# EasyEDA Pro project ProPrj_筷子_2024-10-24-09-22-03.epro

# Schematic Schematic1
Board Name: Board1; Create Date: 2024-10-07
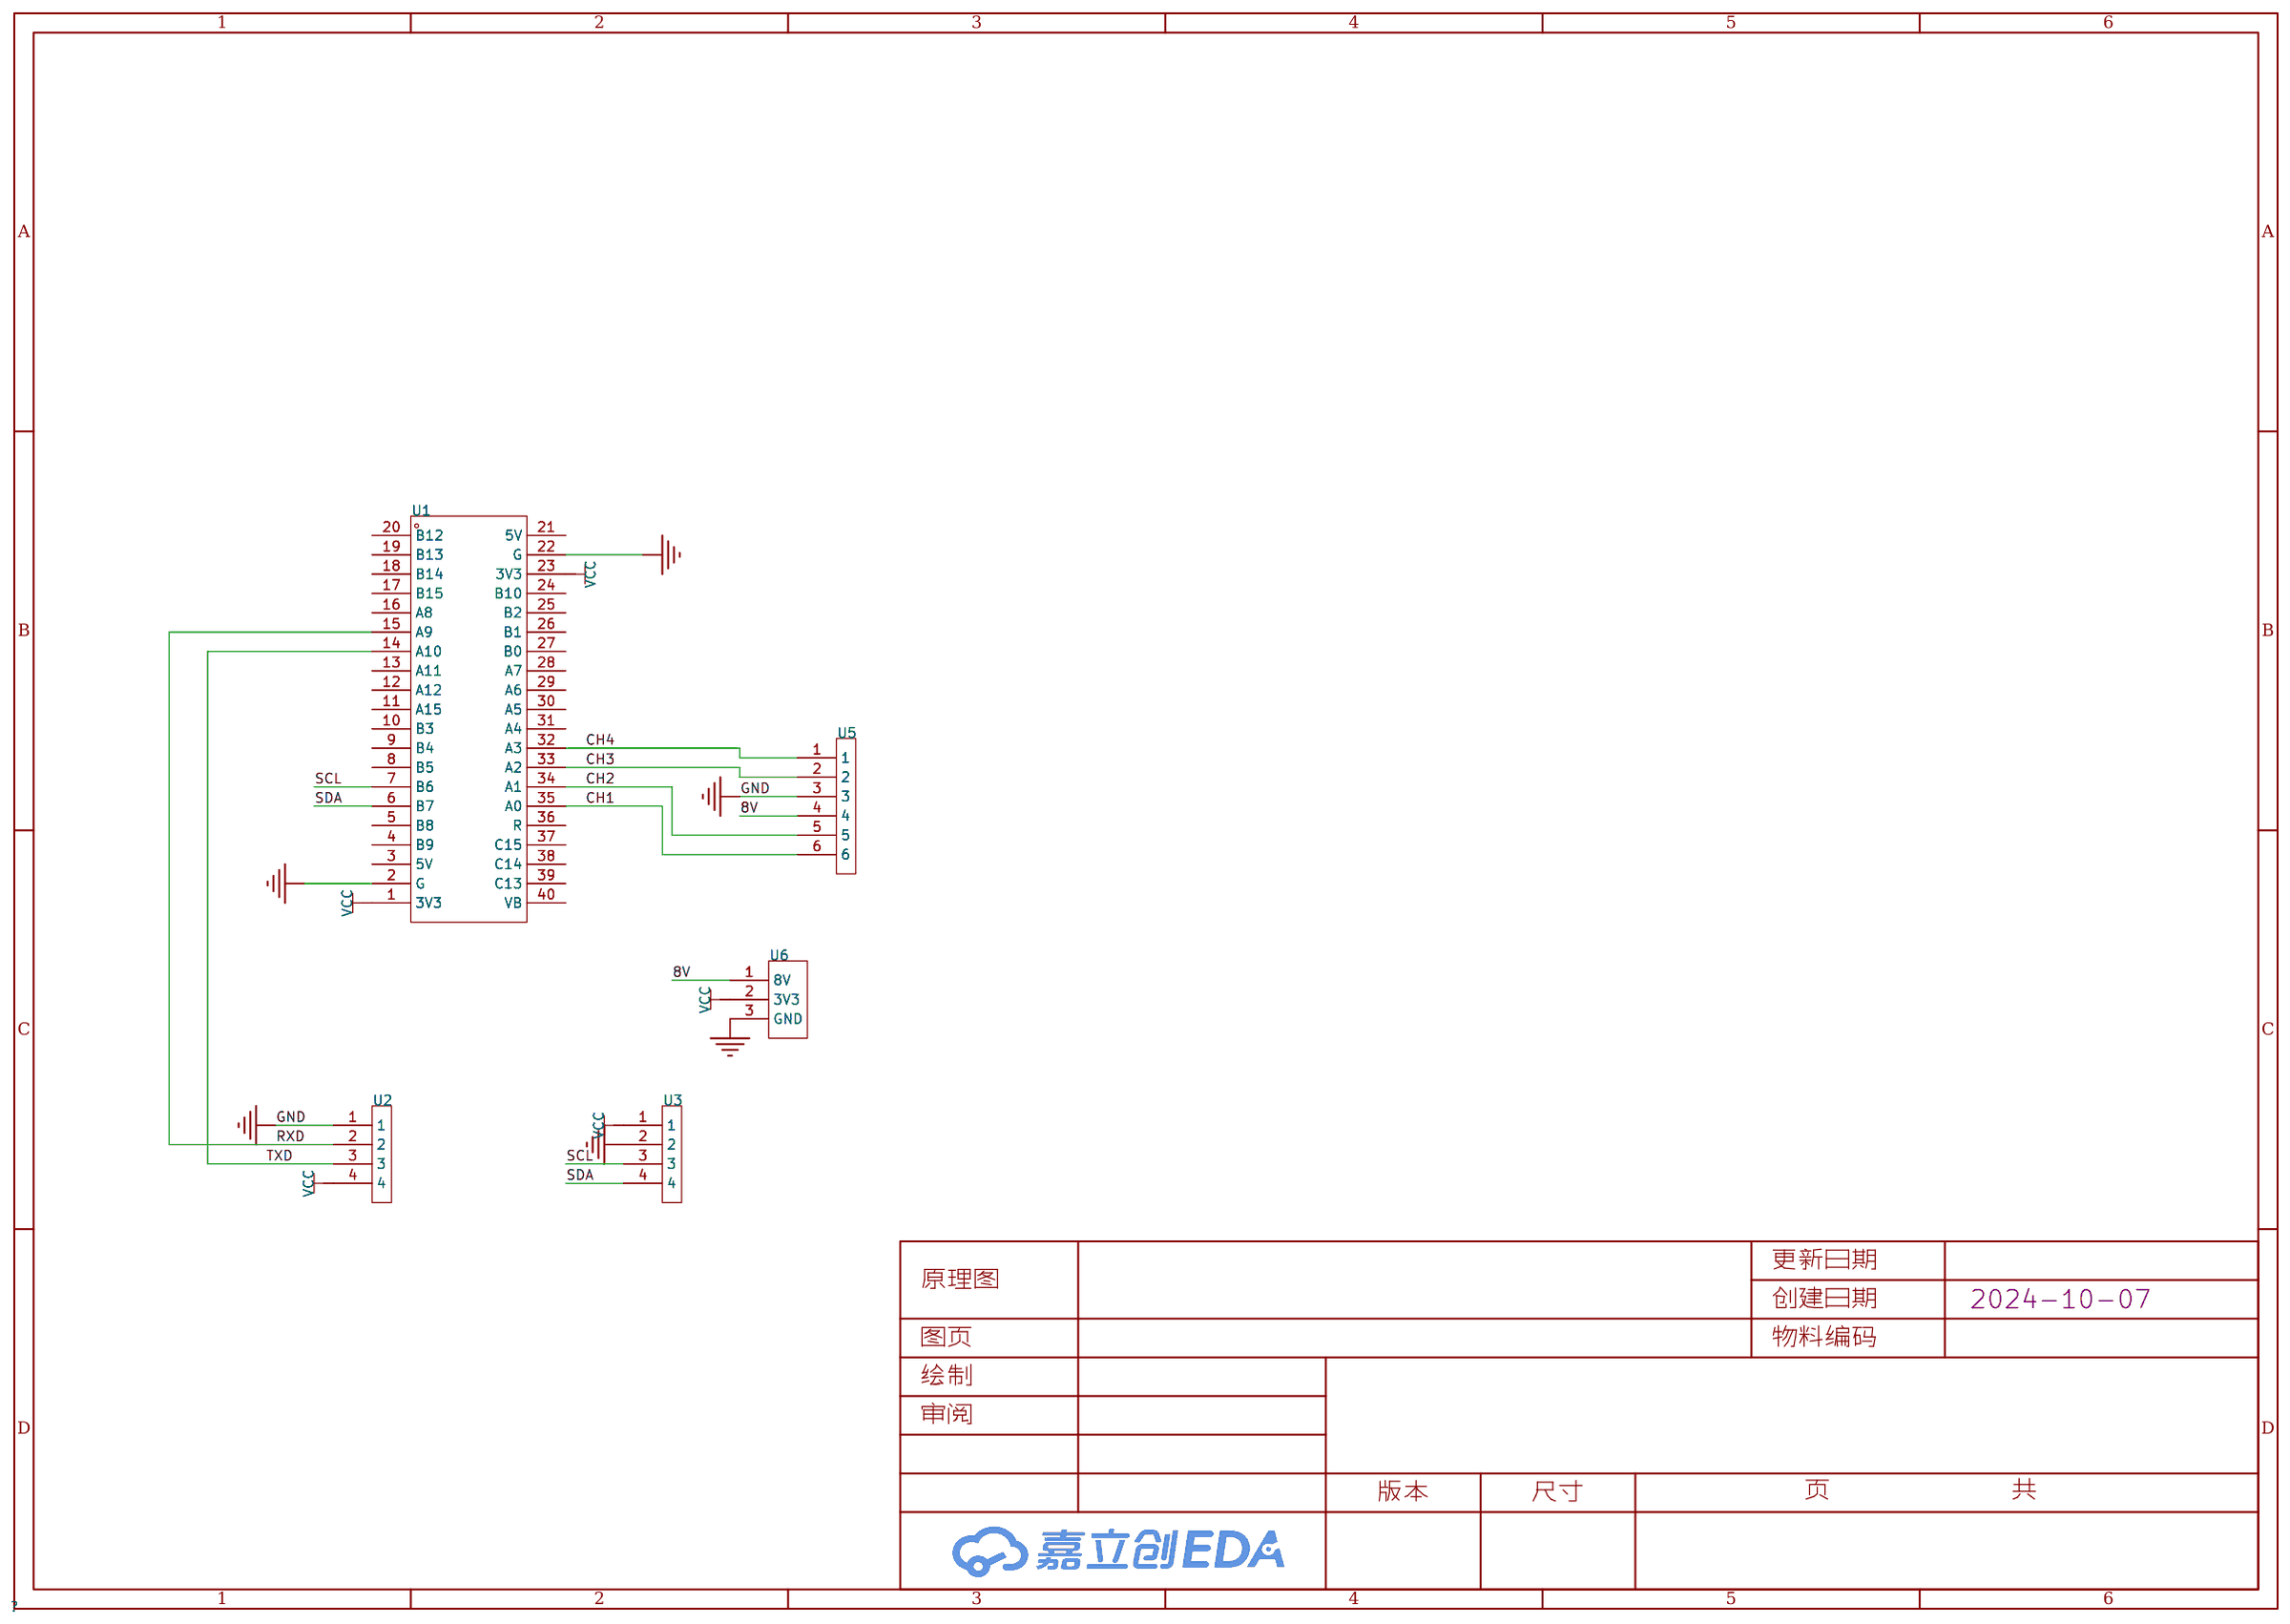
[diagram p0: schematic sheet]

## Parts
U1  -  [不知道]
U2  -  [4pin]
U3  -  [4pin]
U5  -  [6pin]
U6  -  [供电PIN]

## Library data of the parts
U1 = ccu6
U2 U3 = 4pin
U5 = 6pin
U6 = 供电PIN

## Nets
8V: U5.4 U6.1(8V)
GND: U1.2(G) U1.22(G) U2.1 U3.2 U5.3 U6.3(GND)
VCC: U1.1(3V3) U1.23(3V3) U2.4 U3.1 U6.2(3V3)
CH1: U1.35(A0) U5.6
CH2: U1.34(A1) U5.5
CH3: U1.33(A2) U5.2
CH4: U1.32(A3) U5.1
RXD: U1.15(A9) U2.2
SCL: U1.7(B6) U3.3
SDA: U1.6(B7) U3.4
TXD: U1.14(A10) U2.3

Not connected (* = marked no-connect by the designer): U1 3(5V) 4(B9) 5(B8) 8(B5) 9(B4) 10(B3) 11(A15) 12(A12) 13(A11) 16(A8) 17(B15) 18(B14) 19(B13) 20(B12) 21(5V) 24(B10) 25(B2) 26(B1) 27(B0) 28(A7) 29(A6) 30(A5) 31(A4) 36(R) 37(C15) 38(C14) 39(C13) 40(VB)

# Board PCB1
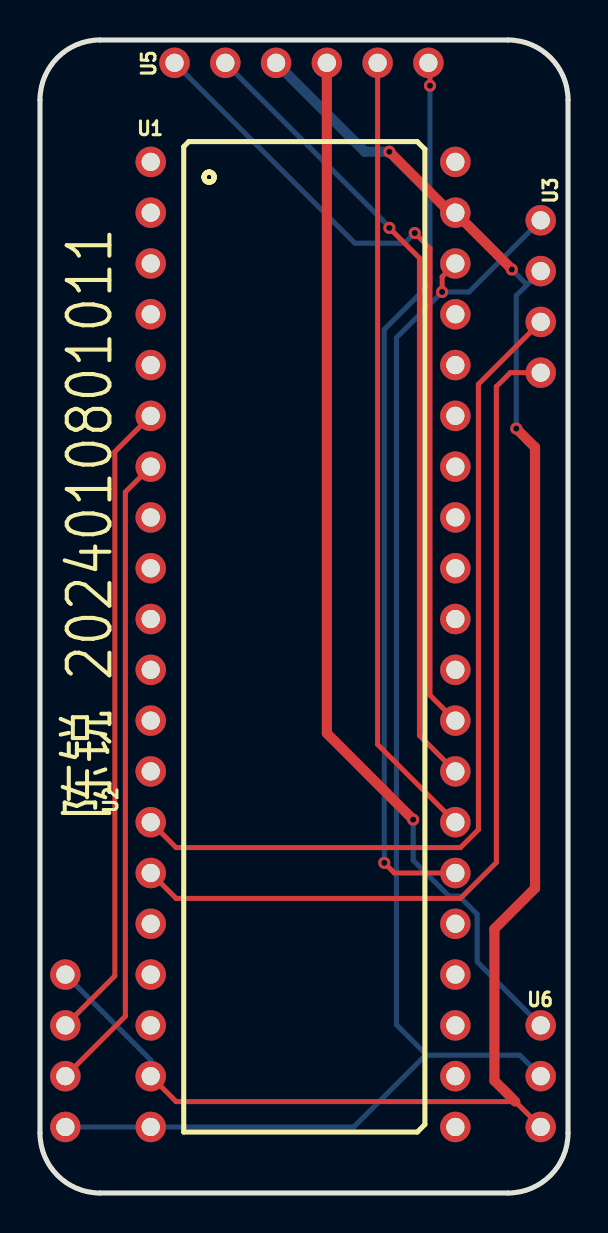
[diagram p1: board, top side]
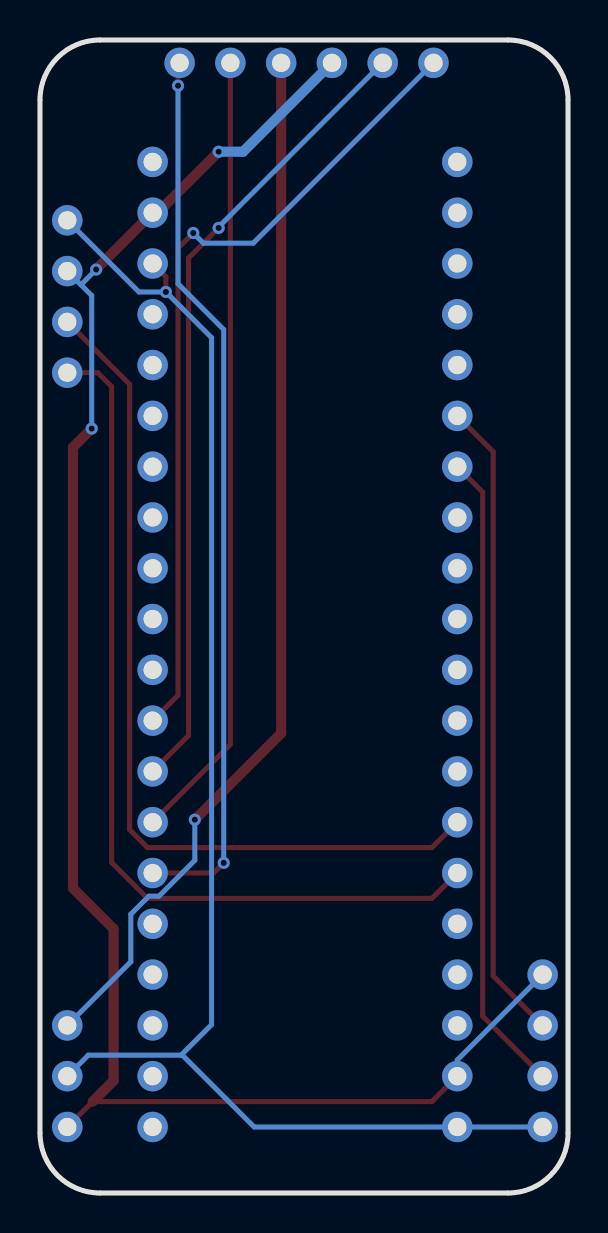
[diagram p2: board, bottom side, seen from below]

Outline 26.42 x 57.66 mm; copper layers: Top Layer, Bottom Layer. Coordinates in mm from the lower left corner of the outline.
Outline path: 0,54.66 0,3 arc(0.88,0.88) 3,0 23.42,0 arc(25.54,0.88) 26.42,3 26.42,54.66 arc(25.54,56.78) 23.42,57.66 3,57.66 arc(0.88,56.78) 0,54.66
Stack: Top Layer 0.035mm / Dielectric1 1.51mm FR4 er 4.5 / Bottom Layer 0.035mm

## Design rules (mm)
template: JLCPCB Capability(Two Layers Board)
spacing copperThickness1oz (default): track to track 0.102, other pairs 0.152 to 0.3
spacing copperThickness2oz: track to track 0.203, other pairs 0.152 to 0.3
track width copperThickness1oz (default): min 0.127, default 0.254, max 2.54
track width copperThickness2oz: min 0.203, default 0.254, max 2.54
differential pair differentialPair (default): width min 0.127, default 0.254, max 2.54; gap min 0.152, default 0.152
via viaSize (default): diameter min 0.5, default 0.61, max 10; hole min 0.3, default 0.305, max 6.3

## Placement (name value [footprint] x y rotation side)
U1  -  [不知道]  5.54 51.94 0 top
U2  -  [4pin]  1.27 10.92 270 top
U3  -  [4pin]  25.05 48.64 270 top
U5  -  [6pin]  6.73 56.51 90 top
U6  -  [供电PIN]  25.05 8.38 0 top

## Footprints (pads in the part's own frame, mm; a bottom-side part is the same pattern mirrored in y, then rotated)
4pin
  round 1.524 hole 0.914: 1(0,0) 2(2.54,0) 3(5.08,0) 4(7.62,0)
6pin
  round 1.524 hole 0.914: 1(0,0) 2(0,-2.54) 3(0,-5.08) 4(0,-7.62) 5(0,-10.16) 6(0,-12.7)
不知道
  round 1.524 hole 0.914: 1(0,-48.641) 2(0,-46.101) 3(0,-43.561) 4(0,-41.021) 5(0,-38.481) 6(0,-35.941) 7(0,-33.401) 8(0,-30.861) 9(0,-28.321) 10(0,-25.781) 11(0,-23.241) 12(0,-20.701) 13(0,-18.161) 14(0,-15.621) 15(0,-13.081) 16(0,-10.541) 17(0,-8.001) 18(0,-5.461) 19(0,-2.921) 20(0,-0.381) 21(15.24,-0.381) 22(15.24,-2.921) 23(15.24,-5.461) 24(15.24,-8.001) 25(15.24,-10.541) 26(15.24,-13.081) 27(15.24,-15.621) 28(15.24,-18.161) 29(15.24,-20.701) 30(15.24,-23.241) 31(15.24,-25.781) 32(15.24,-28.321) 33(15.24,-30.861) 34(15.24,-33.401) 35(15.24,-35.941) 36(15.24,-38.481) 37(15.24,-41.021) 38(15.24,-43.561) 39(15.24,-46.101) 40(15.24,-48.641)
供电PIN
  round 1.524 hole 0.914: 1(0,0) 2(0,-2.54) 3(0,-5.08)

## Nets
As in the schematic.

Pads without a net: U1 3 4 5 8 9 10 11 12 13 16 17 18 19 20 21 24 25 26 27 28 29 30 31 36 37 38 39 40

## Via types
v1: diameter 0.61, hole 0.305, Top Layer to Bottom Layer, 9 vias

## Routing (per net, layer and track width the routed paths; a pad name or vN(x,y) marks a point on that pad's centre or on a via; arc(x,y) is an arc through that point)
8V: length 52.9
  Top Layer w0.508: U5.4 14.35,22.99 v1(18.67,18.67)
  Bottom Layer w0.254: U6.1 21.87,11.56 21.87,13.94 20.97,14.84 20.47,14.84 18.67,16.64 v1(18.67,18.67)
GND: length 88.3
  Top Layer w0.254: U6.3 23.78,4.57 6.81,4.57 U1.2
  Top Layer w0.508: v1(17.48,52.07) 20.53,49.02 U1.22 23.6,46.2 v1(23.6,46.18) ; 23.78,4.57 22.73,5.62 22.73,13.21 24.76,15.24 24.76,37.29 v1(23.83,38.23)
  Bottom Layer w0.254: v1(23.83,38.23) 23.83,44.88 24.37,45.42 ; U2.1 5.54,6.65 U1.2 ; 24.37,45.42 U3.2 ; 24.37,45.42 v1(23.6,46.18)
  Bottom Layer w0.508: U5.3 16.26,52.07 v1(17.48,52.07)
VCC: length 73.6
  Top Layer w0.254: U1.23 20.12,45.82 v1(20.12,45.06)
  Bottom Layer w0.254: U2.4 U1.1 15.7,3.3 19.29,6.89 19.36,6.89 ; U3.1 21.47,45.06 v1(20.12,45.06) 17.83,42.77 17.83,8.42 19.36,6.89 ; 19.36,6.89 24,6.89 U6.2
CH1: length 44.8
  Top Layer w0.254: v1(17.22,16.51) 17.73,16 U1.35 ; 19.43,56.51 19.51,56.44 v1(19.51,55.37)
  Bottom Layer w0.254: v1(19.51,55.37) 19.51,45.47 17.22,43.18 v1(17.22,16.51)
CH2: length 39.6
  Top Layer w0.254: U1.34 16.89,22.43 U5.5
CH3: length 40.2
  Top Layer w0.254: U1.33 18.98,22.88 18.98,46.75 v1(17.48,48.26)
  Bottom Layer w0.254: U5.2 17.48,48.31 v1(17.48,48.26)
CH4: length 41.2
  Top Layer w0.254: v1(18.75,48.01) 19.51,47.24 19.51,24.89 U1.32
  Bottom Layer w0.254: U5.1 15.75,47.5 18.24,47.5 v1(18.75,48.01)
RXD: length 32.2
  Top Layer w0.254: U2.2 3.74,10.86 3.74,37.07 U1.15
SCL: length 44
  Top Layer w0.254: U3.3 21.93,40.44 21.93,18.17 21.03,17.27 6.81,17.27 U1.7
SDA: length 44.9
  Top Layer w0.254: U1.6 6.81,14.73 21.03,14.73 22.83,16.53 22.83,40.32 23.53,41.02 U3.4
TXD: length 32.2
  Top Layer w0.254: U1.14 4.27,35.05 4.27,8.84 U2.3

## Text on the board
Top Silkscreen Layer: 陈锐 2024010801011
